# EAGLE design RF1_12V_RGBFlood (EAGLE 7.4.0)
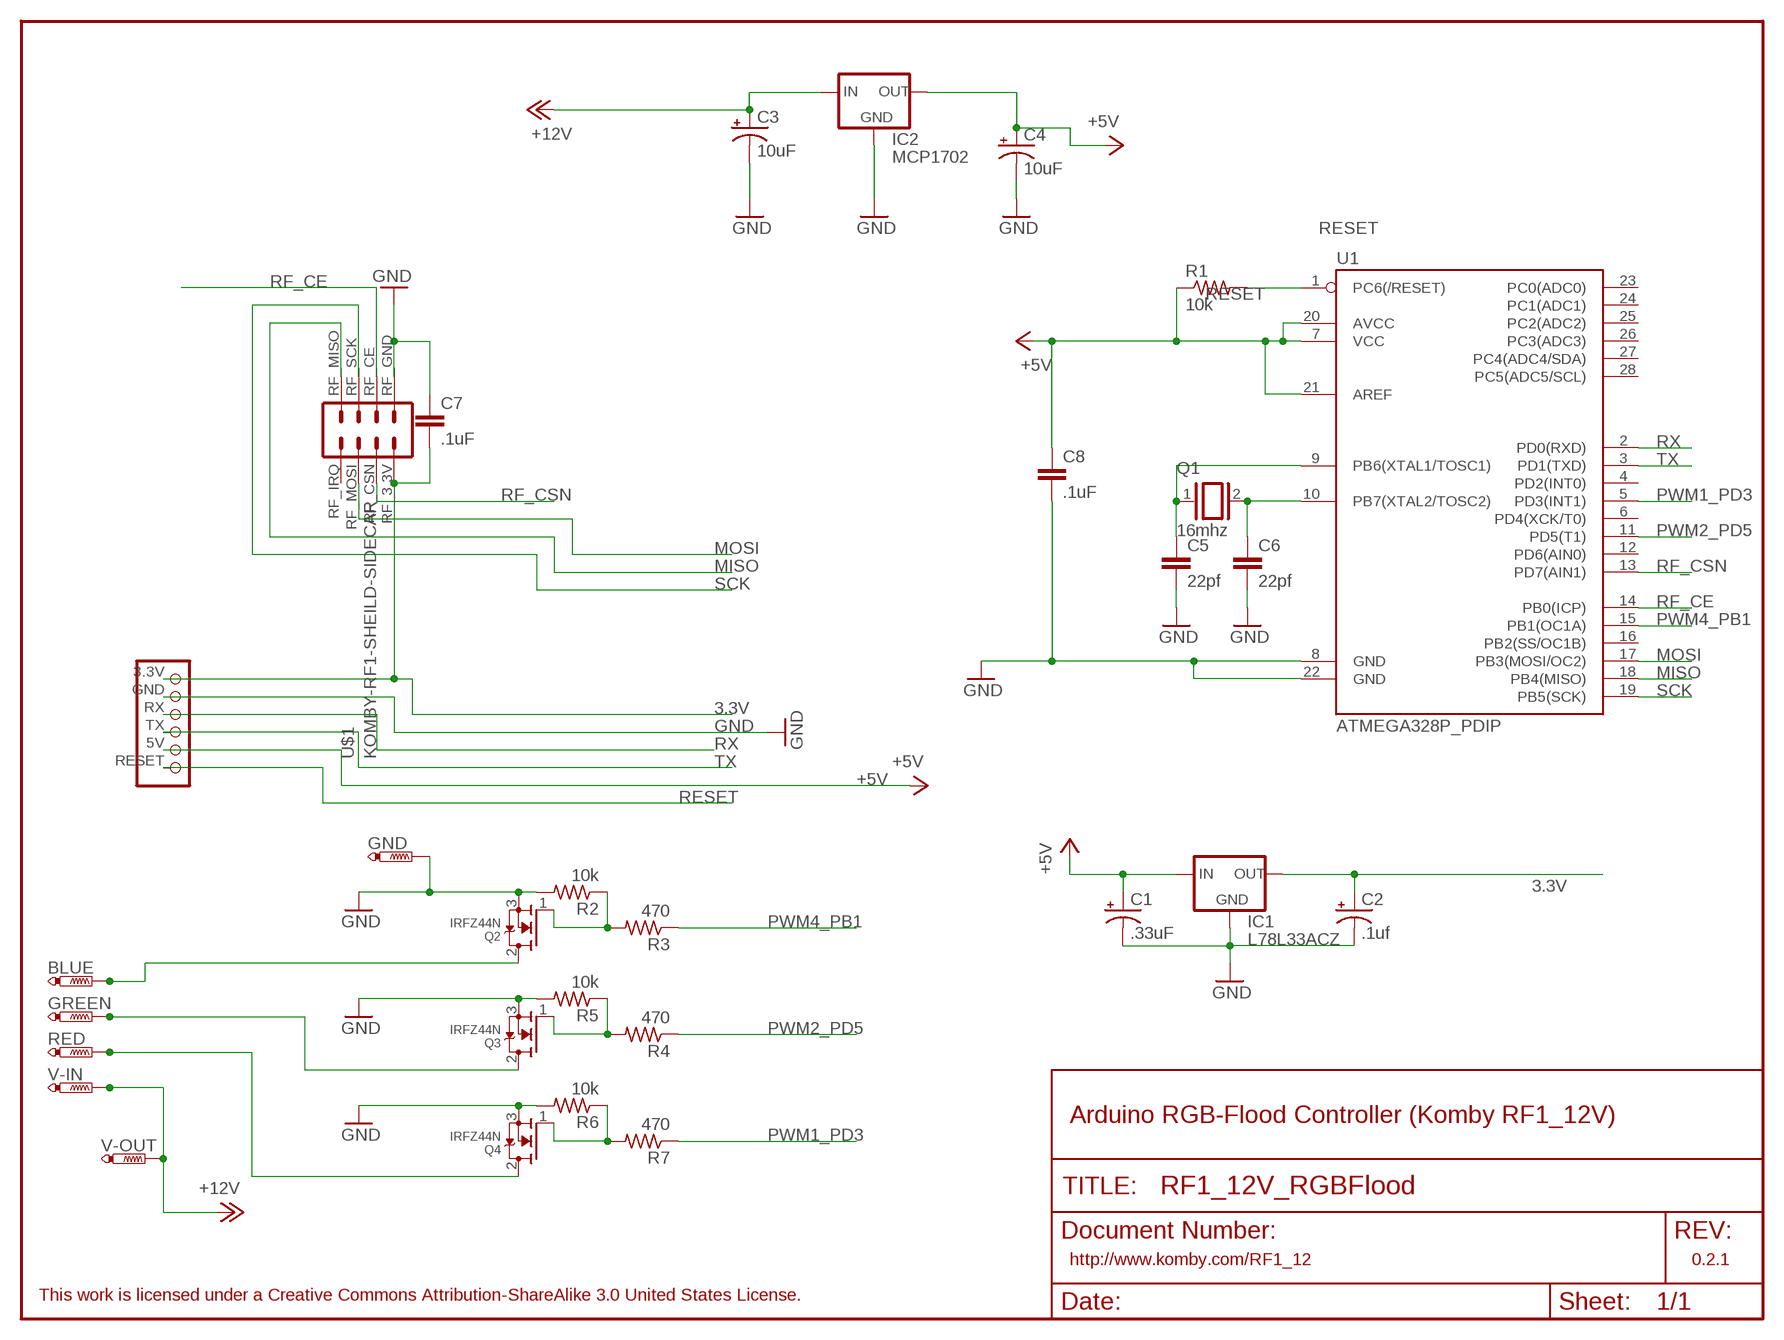
[diagram p0: schematic, sheet 1]

## Parts
BLUE  PTR1PAD1-13Y  [P1-13Y]
C1  .33uF  CPOL-USE1.8-4  [E1,8-4]
C2  .1uf  CPOL-USE1.8-4  [E1,8-4]
C3  10uF  CPOL-USE1.8-4  [E1,8-4]
C4  10uF  CPOL-USE1.8-4  [E1,8-4]
C5  22pf  C-EU025-024X044  [C025-024X044]
C6  22pf  C-EU025-024X044  [C025-024X044]
C7  .1uF  C-EU025-024X044  [C025-024X044]
C8  .1uF  C-EU025-024X044  [C025-024X044]
GND  PTR1PAD1-13Y  [P1-13Y]
GREEN  PTR1PAD1-13Y  [P1-13Y]
IC1  L78L33ACZ  78LXX  [78LXX]
IC2  MCP1702  MCP1700TRI  [TO92]
Q1  16mhz  XTAL/S  [QS]
Q2  IRFZ44N  MOSFET-NGDS_TO220V  [TO220V]
Q3  IRFZ44N  MOSFET-NGDS_TO220V  [TO220V]
Q4  IRFZ44N  MOSFET-NGDS_TO220V  [TO220V]
R1  10k  R-US_0207/7  [0207/7]
R2  10k  R-US_0207/7  [0207/7]
R3  470  R-US_0207/7  [0207/7]
R4  470  R-US_0207/7  [0207/7]
R5  10k  R-US_0207/7  [0207/7]
R6  10k  R-US_0207/7  [0207/7]
R7  470  R-US_0207/7  [0207/7]
RED  PTR1PAD1-13Y  [P1-13Y]
U1  ATMEGA328P_PDIP  [DIL28-3]
U$1  KOMBY-RF1-SHEILD-SIDECAR  [KOMBY-RF1-SIDECAR]
V-IN  PTR1PAD1-13Y  [P1-13Y]
V-OUT  PTR1PAD1-13Y  [P1-13Y]

## Nets
3.3V [vcc]: C2.+ C7.2 IC1.OUT U$1.3.3V U$1.RF_3.3V
+5V [vcc]: C1.+ C4.+ C8.1 IC1.IN IC2.3(OUT) R1.1 U1.7(VCC) U1.20(AVCC) U1.21(AREF) U$1.5V
+12V [+12V]: C3.+ IC2.2(IN) V-IN.TP V-OUT.TP
GND: C1.- C2.- C3.- C4.- C5.2 C6.2 C7.1 C8.2 GND.TP IC1.GND IC2.1(GND) Q2.3(S) Q3.3(S) Q4.3(S) R2.2 R5.2 R6.2 U1.8(GND) U1.22(GND) U$1.GND U$1.RF_GND(RFGND_1)
MISO: U1.18(PB4(MISO)) U$1.RF_MISO
MOSI: U1.17(PB3(MOSI/OC2)) U$1.RF_MOSI
N$5: C6.1 Q1.2 U1.10(PB7(XTAL2/TOSC2))
N$6: C5.1 Q1.1 U1.9(PB6(XTAL1/TOSC1))
PWM1_PD3 [ic1]: R7.1 U1.5(PD3(INT1))
PWM2_PD5 [ic1]: R4.1 U1.11(PD5(T1))
PWM4_PB1 [ic1]: R3.1 U1.15(PB1(OC1A))
RESET: R1.2 U1.1(PC6(/RESET)) U$1.RESET
RF_CE: U1.14(PB0(ICP)) U$1.RF_CE
RF_CSN: U1.13(PD7(AIN1)) U$1.RF_CSN
RGB_N$1 [ic1]: Q2.1(G) R2.1 R3.2
RGB_N$2 [ic1]: Q3.1(G) R4.2 R5.1
RGB_N$3 [ic1]: Q4.1(G) R6.1 R7.2
RGB_N$4 [rgb]: Q4.2(D) RED.TP
RGB_N$7 [rgb]: GREEN.TP Q3.2(D)
RGB_N$8 [rgb]: BLUE.TP Q2.2(D)
RX: U1.2(PD0(RXD)) U$1.RX
SCK: U1.19(PB5(SCK)) U$1.RF_SCK
TX: U1.3(PD1(TXD)) U$1.TX
Unconnected: U1.4(PD2(INT0)) U1.6(PD4(XCK/T0)) U1.12(PD6(AIN0)) U1.16(PB2(SS/OC1B)) U1.23(PC0(ADC0)) U1.24(PC1(ADC1)) U1.25(PC2(ADC2)) U1.26(PC3(ADC3)) U1.27(PC4(ADC4/SDA)) U1.28(PC5(ADC5/SCL)) U$1.RF_IRQ

## Notes on the sheet
- Arduino RGB-Flood Controller (Komby RF1_12V)
- http://www.komby.com/RF1_12 | 0.2.1
- This work is licensed under a Creative Commons Attribution-ShareAlike 3.0 United States License.

## Library data of the parts
BLUE GND GREEN RED V-IN V-OUT = testpad:PTR1: TEST PIN
C1-C4 = adafruit:CPOL-US: POLARIZED CAPACITOR, American symbol
C5-C8 = resistor:C-EU: CAPACITOR, European symbol
IC1 = v-reg:78LXX: VOLTAGE REGULATOR
IC2 = adafruit:MCP1700: VOLTAGE REGULATOR
Q1 = special:XTAL/S: CRYSTAL
Q2-Q4 = adafruit_2:MOSFET-N: N-Channel Mosfet 2N7002E - 60V 260mA SOT23 [Digikey: 2N7002ET1GOSTR-ND] - REEL BSH103 - 30V 850mA SOT23 [Digikey: 568-5013-1-ND]
R1 = adafruit:R-US_: RESISTOR, American symbol
R2-R7 = adafruit_2:R-US_: RESISTOR, American symbol
U1 = SparkFun-DigitalIC:ATMEGA328P_PDIP: uC used in the Arduino 32kb flash, 1k EEPROM, 2k SRAM This is the through-hole version of this chip.
U$1 = rf1-12v-cml:KOMBY-RF1-SHEILD-SIDECAR

## Net classes
0 default: width 0.406 mm
1 vcc: width 0.813 mm
2 gnd: width 0.406 mm
3 +12V: width 1.93 mm
4 rgb: width 1.93 mm
5 ic1: width 0.813 mm

## Board
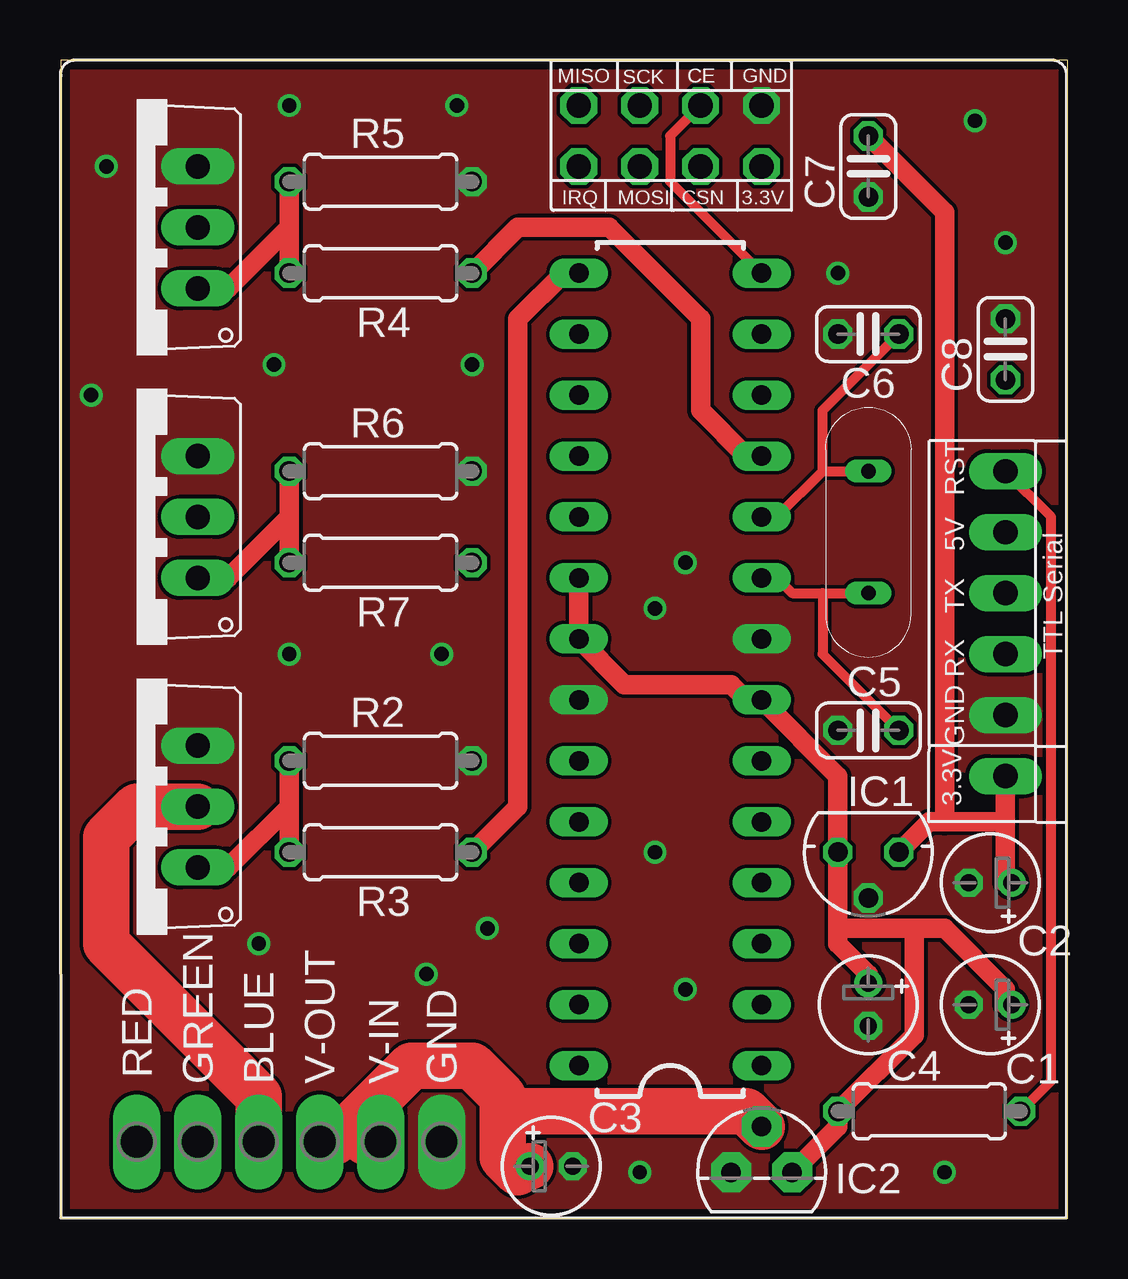
[diagram p1: board, top side]
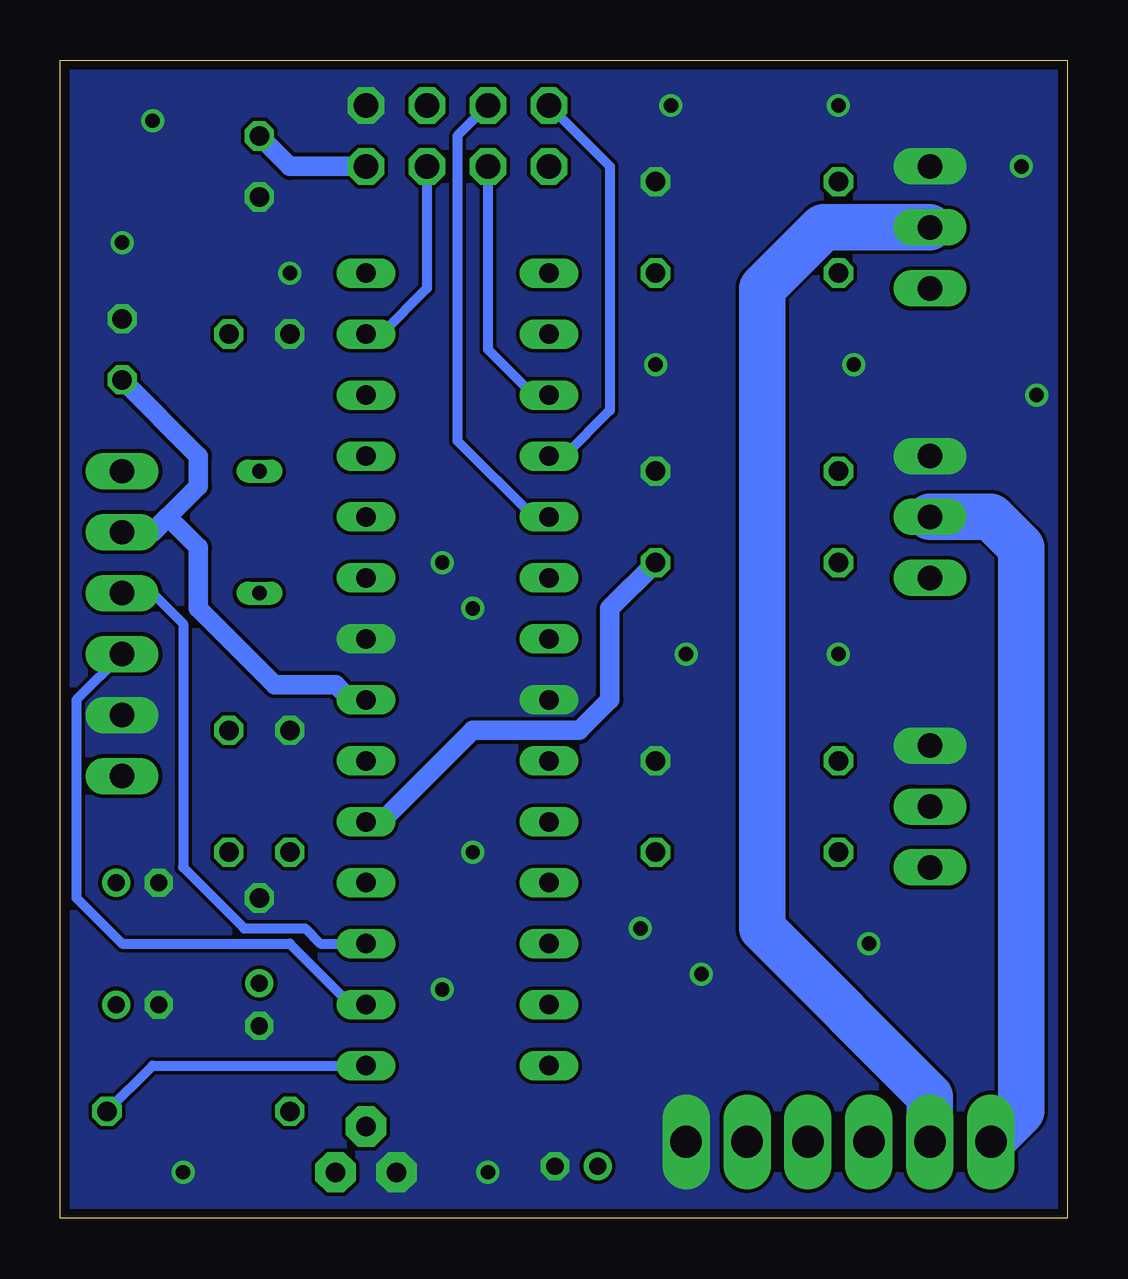
[diagram p2: board, bottom side, seen from below]

Size 41.96 x 48.25 mm. Coordinates in mm from the lower left corner, seen from the top.
Outline: 0,0 41.96,0 41.96,48.25 0,48.25 0,0
Copper layers (1*16): Top 0.0356mm / dielectric 1.5011mm / Bottom 0.0356mm
Design rules "LaenPCBOrder": minimum track width 6mil, minimum drill 13mil, track to track 6mil, track to pad 6mil, pad to pad 6mil, via to via 6mil, smd to smd 6mil, copper to edge 15mil, drill to drill 6mil, minimum pad ring 7mil, minimum via ring 7mil, stop-mask expansion 3mil, vias tented up to drill 0mil, thermal gap 10mil

### Footprints (pad centres in the part's own frame; a part is rotated, then mirrored left to right if it is on the bottom)
P1-13Y = drill 1.321 pad 1.905 long: TP 0,0
E1,8-4 = drill 0.711 pad 1.168: + -0.889,0 | drill 0.711 pad 1.168 octagon: - 0.889,0
C025-024X044 = drill 0.813 octagon: 1 -1.27,0; 2 1.27,0
78LXX = drill 0.813 octagon: GND 0,1.905; IN 1.27,0; OUT -1.27,0
TO92 = drill 0.813 pad 1.676 octagon: 1 -1.27,0; 2 0,1.905; 3 1.27,0
QS = drill 0.61 long: 1 -2.54,0; 2 2.54,0
TO220V = drill 1.016 long: 1 -2.54,-2.54; 2 0,-2.54; 3 2.54,-2.54
0207/7 = drill 0.813 octagon: 1 -3.81,0; 2 3.81,0
DIL28-3 = drill 0.813 long: 1 -16.51,-3.81; 2 -13.97,-3.81; 3 -11.43,-3.81; 4 -8.89,-3.81; 5 -6.35,-3.81; 6 -3.81,-3.81; 7 -1.27,-3.81; 8 1.27,-3.81; 9 3.81,-3.81; 10 6.35,-3.81; 11 8.89,-3.81; 12 11.43,-3.81; 13 13.97,-3.81; 14 16.51,-3.81; 15 16.51,3.81; 16 13.97,3.81; 17 11.43,3.81; 18 8.89,3.81; 19 6.35,3.81; 20 3.81,3.81; 21 1.27,3.81; 22 -1.27,3.81; 23 -3.81,3.81; 24 -6.35,3.81; 25 -8.89,3.81; 26 -11.43,3.81; 27 -13.97,3.81; 28 -16.51,3.81
KOMBY-RF1-SIDECAR = drill 1.016 long: 3.3V 39.37,18.415; 5V 39.37,28.575; GND 39.37,20.955; RESET 39.37,31.115; RX 39.37,23.495; TX 39.37,26.035 | drill 1.016 octagon: RF_3.3V 29.21,43.815; RF_CE 26.67,46.355; RF_CSN 26.67,43.815; RF_GND 29.21,46.355; RF_IRQ 21.59,43.815; RF_MISO 21.59,46.355; RF_MOSI 24.13,43.815; RF_SCK 24.13,46.355

### Placement (x,y rotation side)
BLUE  8.26,3.17 0 top
C1  38.73,8.89 180 top
C2  38.73,13.97 180 top
C3  20.45,2.16 0 top
C4  33.66,8.89 270 top
C5  33.66,20.32 180 top
C6  33.66,36.83 180 top
C7  33.66,43.81 90 top
C8  39.37,36.2 90 top
GND  15.88,3.17 0 top
GREEN  5.71,3.17 0 top
IC1  33.66,15.24 180 top
IC2  29.21,1.91 0 top
Q1  33.66,28.57 90 top
Q2  3.17,17.14 90 top
Q3  3.17,41.27 90 top
Q4  3.17,29.21 90 top
R1  36.2,4.45 0 top
R2  13.34,19.05 0 top
R3  13.34,15.24 180 top
R4  13.34,39.37 180 top
R5  13.34,43.18 0 top
R6  13.34,31.11 0 top
R7  13.34,27.3 180 top
RED  3.17,3.17 0 top
U1  25.4,22.86 90 top
U$1  0,0 0 top
V-IN  13.34,3.17 0 top
V-OUT  10.79,3.17 0 top

### Tracks (layer width: path | path; a pad name or v marks a point on that pad's centre or on a via)
3.3V
  Top 0.813: U$1.3.3V 39.37,16.51 | 39.37,16.51 39.37,13.97 C2.+ | IC1.OUT 36.2,16.51 36.83,16.51 | 39.37,16.51 36.83,16.51 | C7.2 36.83,41.91 36.83,16.51
  Bottom 0.813: C7.2 32.38,43.81 U$1.RF_3.3V
+5V
  Top 0.813: IC2.3 32.38,3.81 R1.1 35.56,7.62 35.56,12.06 | U1.20 U1.21 23.5,22.23 27.94,22.23 28.57,21.59 U1.7 32.38,18.41 IC1.IN 32.38,12.06 | 32.38,12.06 32.38,11.43 33.66,10.16 C4.+ | 32.38,12.06 35.56,12.06 | 35.56,12.06 36.83,12.06 39.37,9.53 39.37,8.89 C1.+
  Bottom 0.813: C8.1 36.2,31.75 36.2,30.48 37.47,29.21 | 37.47,29.21 38.1,28.57 U$1.5V | 37.47,29.21 36.2,27.94 36.2,25.4 33.02,22.23 30.48,22.23 29.84,21.59 U1.7
+12V
  Top 1.93: 18.41,4.45 18.41,5.08 17.14,6.35 14.61,6.35 12.06,3.81 | 18.41,4.45 18.41,2.54 19.05,1.91 C3.+ | 12.06,3.81 11.43,3.17 V-OUT.TP | IC2.2 28.57,4.45 18.41,4.45 | V-IN.TP 12.7,3.17 12.06,3.81
GND  (via drill 0.6)
  other vias: 24.77,25.4 26.04,27.3 1.91,43.81 9.53,46.35 1.27,34.29 8.89,35.56 17.14,35.56 32.38,39.37 39.37,40.64 38.1,45.72 15.88,23.5 9.53,23.5 24.77,15.24 17.78,12.06 15.24,10.16 8.26,11.43 24.13,1.91 36.83,1.91 26.04,9.53 16.51,46.35
  pour Bottom (no thermals): 0,48.26 41.91,48.26 41.91,0 0,0
  pour Top (no thermals): 0,48.26 41.91,48.26 41.91,0 0,0
MISO
  Bottom 0.406: U1.18 20.95,31.75 19.05,33.66 19.05,43.81 U$1.RF_MISO
MOSI
  Bottom 0.406: U1.17 22.23,34.29 24.13,36.2 U$1.RF_MOSI
N$5
  Top 0.406: 31.75,31.11 Q1.2 | 31.75,31.11 29.84,29.21 U1.10 | C6.1 31.75,33.66 31.75,31.11
N$6
  Top 0.406: 31.75,26.04 30.48,26.04 29.84,26.67 U1.9 | 31.75,26.04 Q1.1 | C5.1 31.75,23.5 31.75,26.04
PWM1_PD3
  Bottom 0.813: R7.1 19.05,25.4 19.05,21.59 20.32,20.32 24.77,20.32 28.57,16.51 U1.5
PWM2_PD5
  Top 0.813: R4.1 19.05,41.27 22.86,41.27 26.67,37.47 26.67,33.66 28.57,31.75 U1.11
PWM4_PB1
  Top 0.813: R3.1 19.05,17.14 19.05,37.47 20.95,39.37 U1.15
RESET
  Top 0.406: U$1.RESET 41.27,29.21 41.27,5.71 R1.2
  Bottom 0.406: U1.1 38.1,6.35 R1.2
RF_CE
  Top 0.406: U1.14 25.4,43.18 25.4,45.09 U$1.RF_CE
RF_CSN
  Bottom 0.406: U1.13 28.57,36.83 26.67,38.73 U$1.RF_CSN
RGB_N$1
  Top 0.813: R2.1 9.53,17.14 | 9.53,17.14 R3.2 | Q2.1 6.99,14.61 9.53,17.14
RGB_N$2
  Top 0.813: R5.1 9.53,41.27 | 9.53,41.27 R4.2 | Q3.1 6.99,38.73 9.53,41.27
RGB_N$3
  Top 0.813: R6.1 9.53,29.21 | 9.53,29.21 R7.2 | Q4.1 6.99,26.67 9.53,29.21
RGB_N$4
  Bottom 1.93: Q4.2 3.17,29.21 1.91,27.94 1.91,4.45 RED.TP
RGB_N$7
  Bottom 1.93: Q3.2 10.16,41.27 12.7,38.73 12.7,12.06 5.71,5.08 GREEN.TP
RGB_N$8
  Top 1.93: Q2.2 3.17,17.14 1.91,15.88 1.91,11.43 8.26,5.08 BLUE.TP
RX
  Bottom 0.406: U1.2 29.84,8.89 32.38,11.43 39.37,11.43 41.27,13.34 41.27,21.59 U$1.RX
SCK
  Bottom 0.406: U1.19 22.23,29.21 25.4,32.38 25.4,45.09 U$1.RF_SCK
TX
  Bottom 0.406: U1.3 31.11,11.43 31.75,12.06 34.29,12.06 36.83,14.61 36.83,24.77 38.1,26.04 U$1.TX